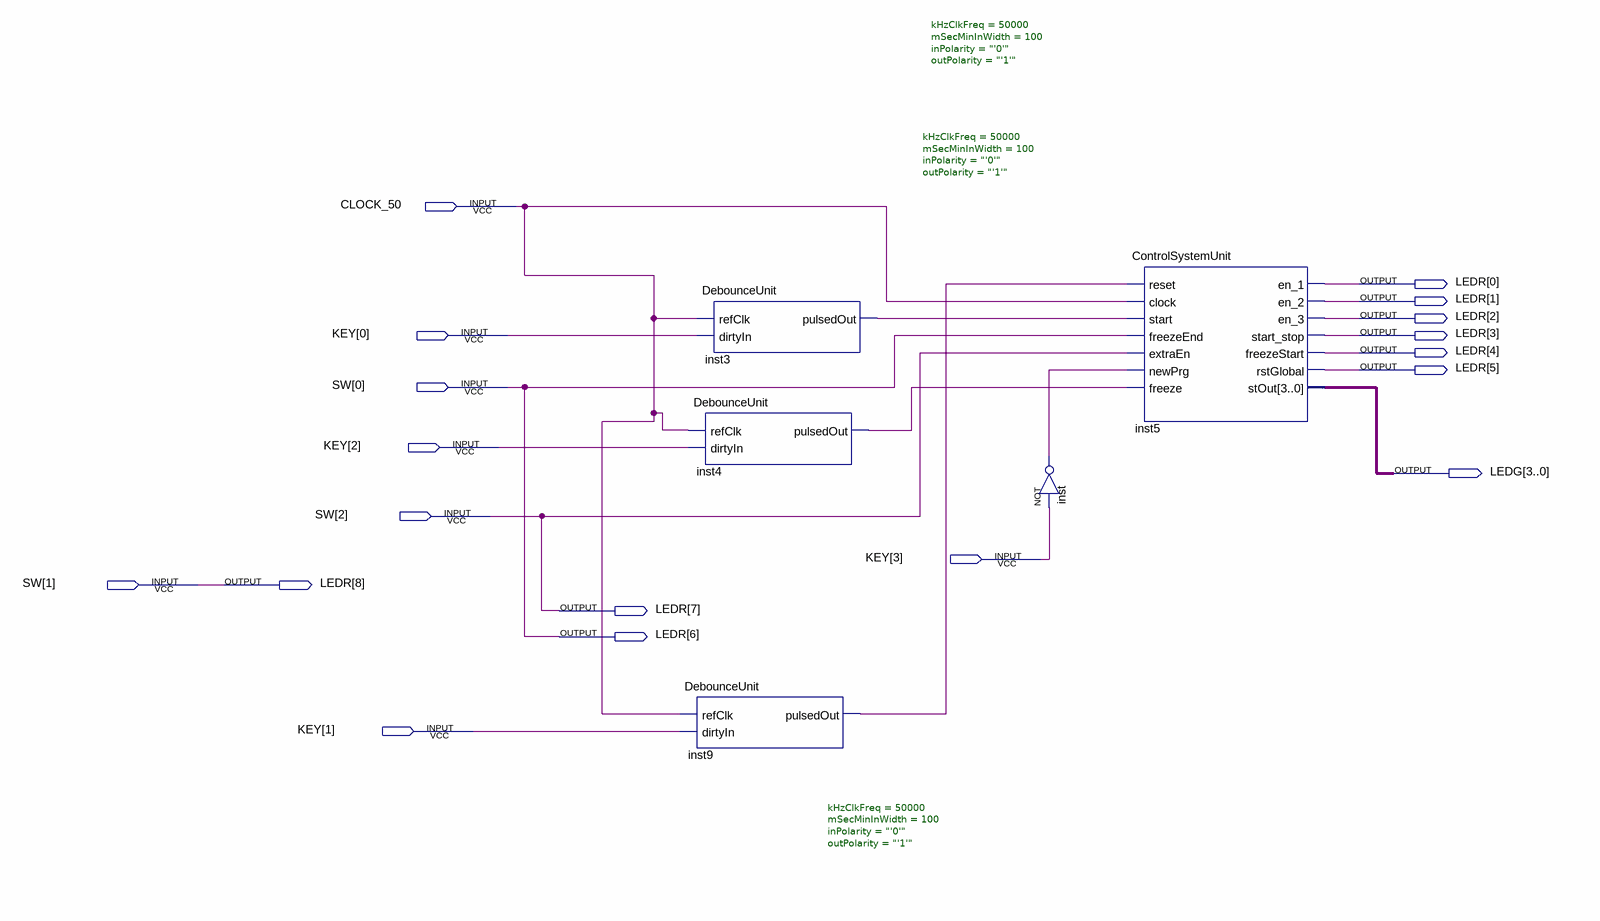
[diagram p0: schematic sheet]
// Quartus schematic demo.bdf as structural Verilog: 5 symbols, 18 pins
module demo (
  input  CLOCK_50,
  input  [3:0] KEY,
  input  [2:0] SW,
  output [8:0] LEDR,
  output [3:0] LEDG
);

  wire inst3_pulsedout, inst4_pulsedout, inst9_pulsedout, inst_out;

  DebounceUnit #(.kHzClkFreq(50000), .mSecMinInWidth(100), .inPolarity("'0'"), .outPolarity("'1'")) inst3 (
    .refClk(CLOCK_50), .dirtyIn(KEY[0]), .pulsedOut(inst3_pulsedout));
  DebounceUnit #(.kHzClkFreq(50000), .mSecMinInWidth(100), .inPolarity("'0'"), .outPolarity("'1'")) inst4 (
    .refClk(CLOCK_50), .dirtyIn(KEY[2]), .pulsedOut(inst4_pulsedout));
  DebounceUnit #(.kHzClkFreq(50000), .mSecMinInWidth(100), .inPolarity("'0'"), .outPolarity("'1'")) inst9 (
    .refClk(CLOCK_50), .dirtyIn(KEY[1]), .pulsedOut(inst9_pulsedout));
  not inst (inst_out, KEY[3]);
  ControlSystemUnit inst5 (
    .reset(inst9_pulsedout), .clock(CLOCK_50), .start(inst3_pulsedout), .freezeEnd(SW[0]), .extraEn(SW[2]),
    .newPrg(inst_out), .freeze(inst4_pulsedout), .en_1(LEDR[0]), .en_2(LEDR[1]), .en_3(LEDR[2]),
    .start_stop(LEDR[3]), .freezeStart(LEDR[4]), .rstGlobal(LEDR[5]), .stOut(LEDG));

  assign LEDR[8:6] = {SW[1], SW[2], SW[0]};
endmodule
